# Altium project Motor-42.PrjPCB
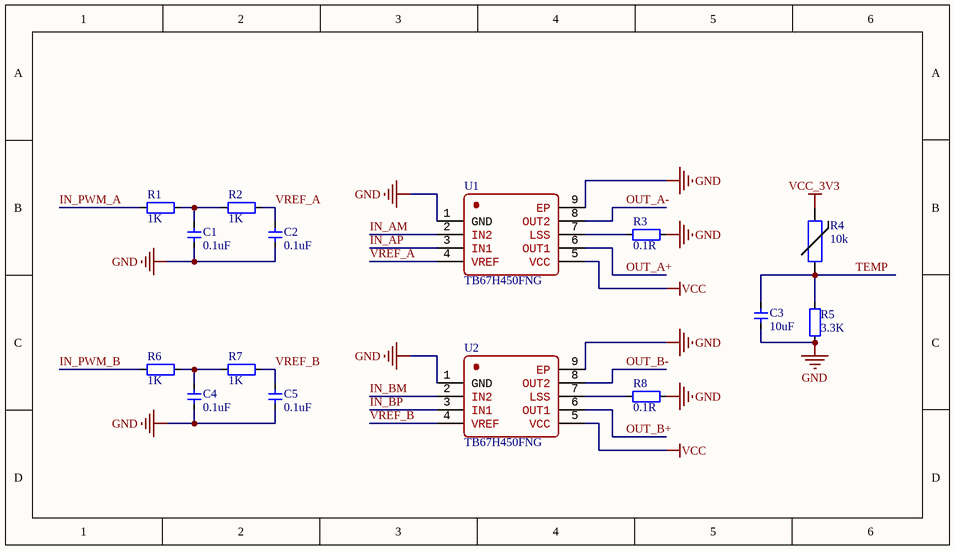
[diagram p0: Drive.SchDoc]
5 sheets, 78 parts. Net scope: global (net labels, ports and power ports of the same name join across sheets).
Board file: Motor-42.PcbDoc
Sheets:
  Drive.SchDoc
  MCU.SchDoc
  Port.SchDoc
  Power.SchDoc
  Interface.SchDoc

## Sheet Drive.SchDoc
size 177 x 101 mm; SheetNumber: 1; SheetTotal: 1

### Parts
C1  0.1uF  [CAP_0402]
C2  0.1uF  [CAP_0402]
C3  10uF  [CAP_0402]
C4  0.1uF  [CAP_0402]
C5  0.1uF  [CAP_0402]
R1  1K  [RES_0402]
R2  1K  [RES_0402]
R3  0.1R  [1206-RES]
R4  value 10k  [RES_0402]  (hidden comment: NCP15XH103F03RC)
R5  3.3K  [RES_0402]
R6  1K  [RES_0402]
R7  1K  [RES_0402]
R8  0.1R  [1206-RES]
U1  TB67H450FNG  [SO-8-PAD]
U2  TB67H450FNG  [SO-8-PAD]

### Nets
GND: C1.1 C2.1 C3.1 C4.1 C5.1 R3.2 R5.1 R8.2 U1.1(GND) U1.9(EP) U2.1(GND) U2.9(EP)
VCC: U1.5(VCC) U2.5(VCC)
VCC_3V3: R4.2
IN_AM: U1.2(IN2)
IN_AP: U1.3(IN1)
IN_BM: U2.2(IN2)
IN_BP: U2.3(IN1)
IN_PWM_A: R1.1
IN_PWM_B: R6.1
OUT_A+: U1.6(OUT1)
OUT_A-: U1.8(OUT2)
OUT_B+: U2.6(OUT1)
OUT_B-: U2.8(OUT2)
TEMP: C3.2 R4.1 R5.2
VREF_A: C2.2 R2.2 U1.4(VREF)
VREF_B: C5.2 R7.2 U2.4(VREF)
NetC1_2: C1.2 R1.2 R2.1
NetC4_2: C4.2 R6.2 R7.1
NetR3_1: R3.1 U1.7(LSS)
NetR8_1: R8.1 U2.7(LSS)

### Library data of the parts
C1-C5 = 电容-0402: Capacitor; Value: 0.1u
R1 R2 R5-R7 = 电阻-0402: Resistor; Value: 22R
R3 R8 = 电阻-1206: Resistor; Value: 22R
R4 = NCP15XH103F03RC: THERMISTOR 10K OHM NTC 0402 SMD
U1 U2 = TB67H450FNG: PWM Chopper Type DC Brushed Motor Driver

## Sheet MCU.SchDoc
size 177 x 114 mm; SheetNumber: 1; SheetTotal: 1
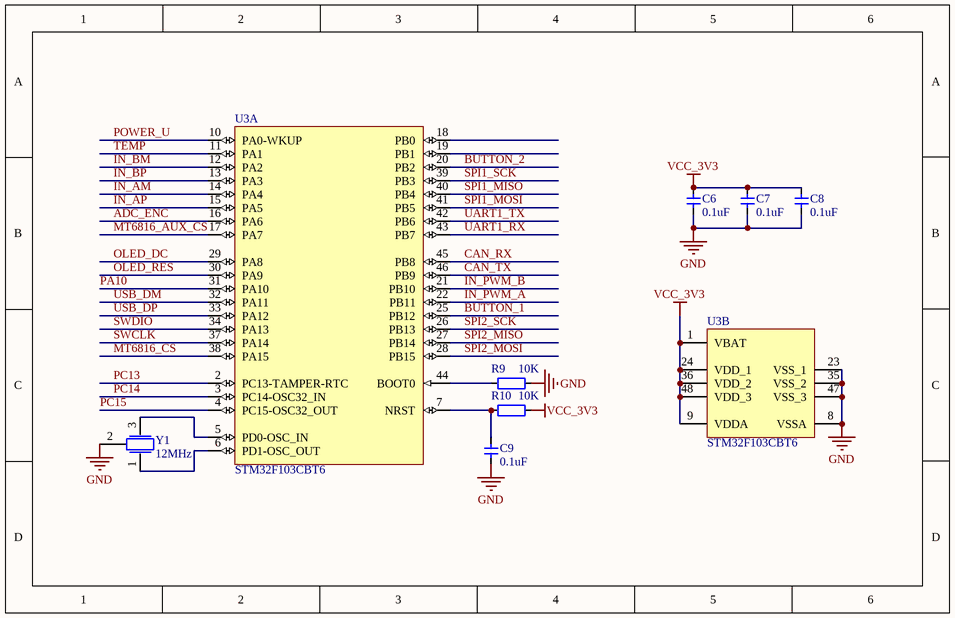
[diagram p1: MCU.SchDoc]

### Parts
C6  0.1uF  [CAP_0402]
C7  0.1uF  [CAP_0402]
C8  0.1uF  [CAP_0402]
C9  0.1uF  [CAP_0402]
R9  10K  [RES_0402]
R10  10K  [RES_0402]
U3  STM32F103CBT6  [LQFP-48]  (parts A,B of 2)
Y1  12MHz  [晶振-3P]

### Nets
GND: C6.1 C7.1 C8.1 C9.1 R9.2 U3.8(VSSA) U3.23(VSS_1) U3.35(VSS_2) U3.47(VSS_3) Y1.2
VCC_3V3: C6.2 C7.2 C8.2 R10.2 U3.1(VBAT) U3.9(VDDA) U3.24(VDD_1) U3.36(VDD_2) U3.48(VDD_3)
ADC_ENC: U3.16(PA6)
BUTTON_1: U3.25(PB12)
BUTTON_2: U3.20(PB2)
CAN_RX: U3.45(PB8)
CAN_TX: U3.46(PB9)
IN_AM: U3.14(PA4)
IN_AP: U3.15(PA5)
IN_BM: U3.12(PA2)
IN_BP: U3.13(PA3)
IN_PWM_A: U3.22(PB11)
IN_PWM_B: U3.21(PB10)
MT6816_AUX_CS: U3.17(PA7)
MT6816_CS: U3.38(PA15)
OLED_DC: U3.29(PA8)
OLED_RES: U3.30(PA9)
PA10: U3.31(PA10)
PC13: U3.2(PC13-TAMPER-RTC)
PC14: U3.3(PC14-OSC32_IN)
PC15: U3.4(PC15-OSC32_OUT)
POWER_U: U3.10(PA0-WKUP)
SPI1_MISO: U3.40(PB4)
SPI1_MOSI: U3.41(PB5)
SPI1_SCK: U3.39(PB3)
SPI2_MISO: U3.27(PB14)
SPI2_MOSI: U3.28(PB15)
SPI2_SCK: U3.26(PB13)
SWCLK: U3.37(PA14)
SWDIO: U3.34(PA13)
TEMP: U3.11(PA1)
UART1_RX: U3.43(PB7)
UART1_TX: U3.42(PB6)
USB_DM: U3.32(PA11)
USB_DP: U3.33(PA12)
NetC9_2: C9.2 R10.1 U3.7(NRST)
NetR9_1: R9.1 U3.44(BOOT0)
NetU3_5: U3.5(PD0-OSC_IN) Y1.3
NetU3_6: U3.6(PD1-OSC_OUT) Y1.1

Not connected (* = marked no-connect by the designer): U3 18(PB0) 19(PB1)

### Library data of the parts
C6-C9 = 电容-0402: Capacitor; Value: 0.1u
R9 R10 = 电阻-0402: Resistor; Value: 22R
U3 = STM32F103CBT6: ARM Cortex-M3 32-bit MCU, 128 KB Flash, 20 KB Internal RAM, 37 I/Os, 48-pin LQFP, -40 to 85 degC, Tray; A/D Converter: 2x12-bit (10 Channel); FLASH Size (Prog) (kB): 128; I/Os (High Current): 37; Internal RAM Size (kB): 20; Operating Frequency(F) (Processor speed) (MHz): 72; Supply Voltage(Vcc) min (V): 2; DatasheetVersion: Rev. 16; PackageVersion: Rev. 6, 06/2013; PackageReference: LQFP48; PackageDescription: 48-Pin Low Profile Quad Flat Package, 7 x 7 mm Body, 0.5 mm Pitch; Supplier 1: Digi-Key; Supplier Part Number 1: 497-6288-ND; Supplier 2: Farnell; Supplier Part Number 2: 1606327; Supplier 3: Newark; Supplier Part Number 3: 11N8296; Supplier 4: Newark; Supplier Part Number 4: 57P1214; Supplier 5: Mouser; Supplier Part Number 5: 511-STM32F103CBT6; Core: ARM Cortex-M3; Packing: Tray; Mounting Technology: Surface Mount; PartNumber: STM32F103CBT6; ComponentLink1Description: Manufacturer URL; ComponentLink1URL: http://www.st.com/web/en/home.html; ComponentLink2Description: Datasheet; ComponentLink2URL: http://www.st.com/st-web-ui/static/active/en/resource/technical/document/datasheet/CD00161566.pdf; ComponentLink3Description: Package Specification; ComponentLink3URL: http://www.st.com/st-web-ui/static/active/en/resource/technical/document/datasheet/DM00058181.pdf
Y1 = 晶振-3Pin: 村田贴片

## Sheet Port.SchDoc
size 177 x 165 mm; SheetNumber: 1; SheetTotal: 1
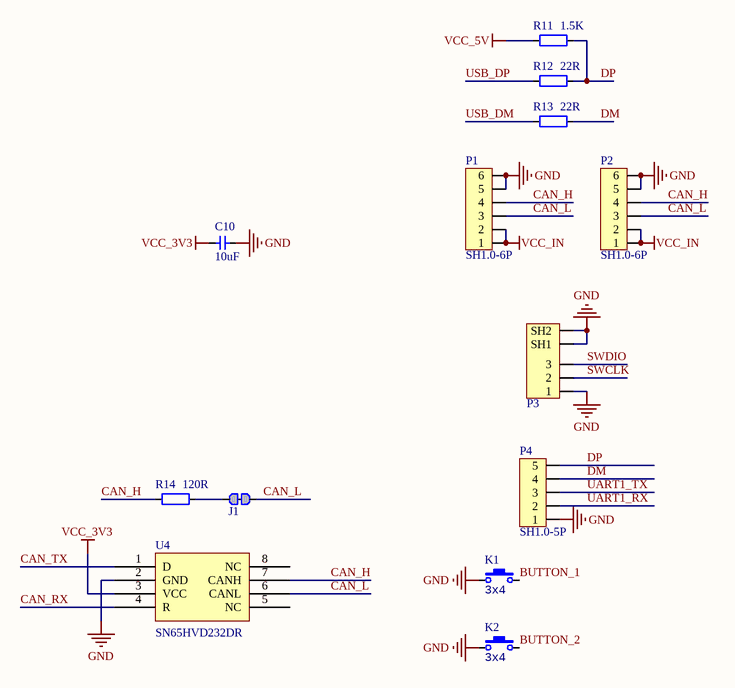
[diagram p2: Port.SchDoc]

### Parts
C10  10uF  [CAP_0402]
J1  跳线  [0402-0R]  (value not drawn)
K1  value 3x4  [ButtonTACT_3x4x2_180]  (hidden comment: TACT 2P)
K2  value 3x4  [ButtonTACT_3x4x2_180]  (hidden comment: TACT 2P)
P1  SH1.0-6P  [SH1.0-6P]
P2  SH1.0-6P  [SH1.0-6P]
P3  SH1.0-3P  [SH1.0-3P]  (value not drawn)
P4  SH1.0-5P  [SH1.0-5P]
R11  1.5K  [RES_0402]
R12  22R  [RES_0402]
R13  22R  [RES_0402]
R14  120R  [RES_0402]
U4  Manufacturer Part Number: SN65HVD232DR  [SO-8]  (hidden comment: SN65HVD232D)

### Nets
GND: C10.1 K1.1 K2.1 P1.5 P1.6 P2.5 P2.6 P3.1 P3.SH1 P3.SH2 P4.1 U4.2(GND)
VCC_3V3: C10.2 U4.3(VCC)
VCC_5V: R11.1
VCC_IN: P1.1 P1.2 P2.1 P2.2
BUTTON_1: K1.2
BUTTON_2: K2.2
CAN_H: P1.4 P2.4 R14.1 U4.7(CANH)
CAN_L: J1.2 P1.3 P2.3 U4.6(CANL)
CAN_RX: U4.4(R)
CAN_TX: U4.1(D)
DM: P4.4 R13.2
DP: P4.5 R11.2 R12.2
SWCLK: P3.2
SWDIO: P3.3
UART1_RX: P4.2
UART1_TX: P4.3
USB_DM: R13.1
USB_DP: R12.1
NetJ1_1: J1.1 R14.2

Not connected (* = marked no-connect by the designer): U4 5(NC) 8(NC)

### Library data of the parts
C10 = 电容-0402: Capacitor; Value: 0.1u
J1 = 跳线: Resistor; Published: 8-Jun-2000; LatestRevisionDate: 17-Jul-2002; LatestRevisionNote: Re-released for DXP Platform.; PackageReference: AXIAL-0.4; Publisher: Altium Limited; PackageDescription: Axial Device, Thru-Hole; 2 Leads; 0.4 in Pin Spacing
K1 K2 = ButtonTACT_3x4x2_180: Button; type: TACT 2P
P3 = SH1.0-3P: Header
R11 R14 = 电阻-0402: Resistor; Value: 22R
R12 R13 = 电阻-0402: Resistor; Value: 22R
U4 = SN65HVD232D: Manufacturer: Texas Instruments; Protocol: CAN; Number of Drivers/Receivers: 1/1; Duplex: Half; Data Rate: 1Mbps; Voltage - Supply: 3 V ~ 3.6 V; Supplier 1: Digi-Key; Supplier Part Number 1: 296-26344-2-ND; RoHS: RoHS Compliant; Category: Integrated Circuits (ICs); Stock: 5000; Pricing 1: 2500=0.84375 (USD); Packaging: Tape & Reel (TR); Part Status: Active; Type: Transceiver; Operating Temperature: -40°C ~ 85°C; Mounting Type: Surface Mount; Package / Case: 8-SOIC (0.154", 3.90mm Width); Supplier Device Package: 8-SOIC; ComponentLink1URL: http://www.ti.com/lit/ds/symlink/sn65hvd230.pdf; ComponentLink1Description: http://www.ti.com/lit/ds/symlink/sn65hvd230.pdf; Supplier 2: Digi-Key; Supplier Part Number 2: 296-26344-1-ND; Pricing 2: 1=2.05, 10=1.842, 100=1.4809, 500=1.21668, 1000=1.00811 (USD)

## Sheet Power.SchDoc
size 127 x 165 mm; SheetNumber: 1; SheetTotal: 1
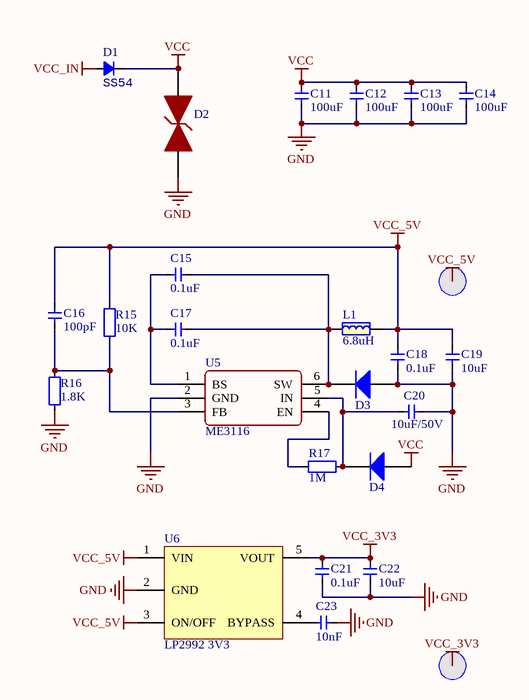
[diagram p3: Power.SchDoc]

### Parts
(Parts that share a designator on the sheet are numbered #1, #2 ... from top to bottom, then left to right.)
C11  100uF  [1206-CAP]
C12  100uF  [1206-CAP]
C13  100uF  [1206-CAP]
C14  100uF  [1206-CAP]
C15  0.1uF  [CAP_0402]
C16  100pF  [CAP_0402]
C17  0.1uF  [CAP_0402]
C18  0.1uF  [CAP_0402]
C19  10uF  [CAP_0402]
C20  10uF/50V  [CAP_0402]
C21  0.1uF  [CAP_0402]
C22  10uF  [CAP_0402]
C23  10nF  [CAP_0402]
D1  SS54  [DO-214AC]
D2  SMBJ28CA  [SMBJ-CA_MFG]  (value not drawn)
D3  二极管-5819W  [SOD-323]  (value not drawn)
D4  二极管-5819W  [SOD-323]  (value not drawn)
L1  6.8uH  [IND-201612]
R15  10K  [RES_0402]
R16#1  1.8K  [RES_0402]
R17#1  1M  [RES_0402]
T1  测试点  [TEST_PT]  (value not drawn)
T2  测试点  [TEST_PT]  (value not drawn)
U5  ME3116  [SOT23-6]
U6  LP2992 3V3  [SOT23-5]

### Nets
GND: C11.1 C12.1 C13.1 C14.1 C18.1 C19.1 C20.1 C21.1 C22.1 C23.1 D2.1 D3.1(A) R16#1.1 U5.2(GND) U6.2(GND)
VCC: C11.2 C12.2 C13.2 C14.2 D1.2(K) D2.2 D4.1(A)
VCC_3V3: C21.2 C22.2 T2.0 U6.5(VOUT)
VCC_5V: C16.1 C18.2 C19.2 L1.2 R15.2 T1.0 U6.1(VIN) U6.3(ON/OFF)
VCC_IN: D1.1(A)
NetC15_1: C15.1 C17.1 D3.2(K) L1.1 U5.6(SW)
NetC15_2: C15.2 C17.2 U5.1(BS)
NetC16_2: C16.2 R15.1 R16#1.2 U5.3(FB)
NetC20_2: C20.2 D4.2(K) R17#1.1 U5.5(IN)
NetC23_2: C23.2 U6.4(BYPASS)
NetR17#1_2: R17#1.2 U5.4(EN)

### Library data of the parts
C11-C14 = 电容-1206: Capacitor; Value: 0.1u
C15-C23 = 电容-0402: Capacitor; Value: 0.1u
D1 = Diode_SMA: Diode; Type: SMA; Value: SS54
D3 D4 = 二极管-5819W: 40V
L1 = 电感-201612
R15 R16#1 R17#1 = 电阻-0402: Resistor; Value: 22R
U5 = ME3116: DC-DC
U6 = LP2992: LDO

## Sheet Interface.SchDoc
size 203 x 165 mm; SheetNumber: 1; SheetTotal: 1
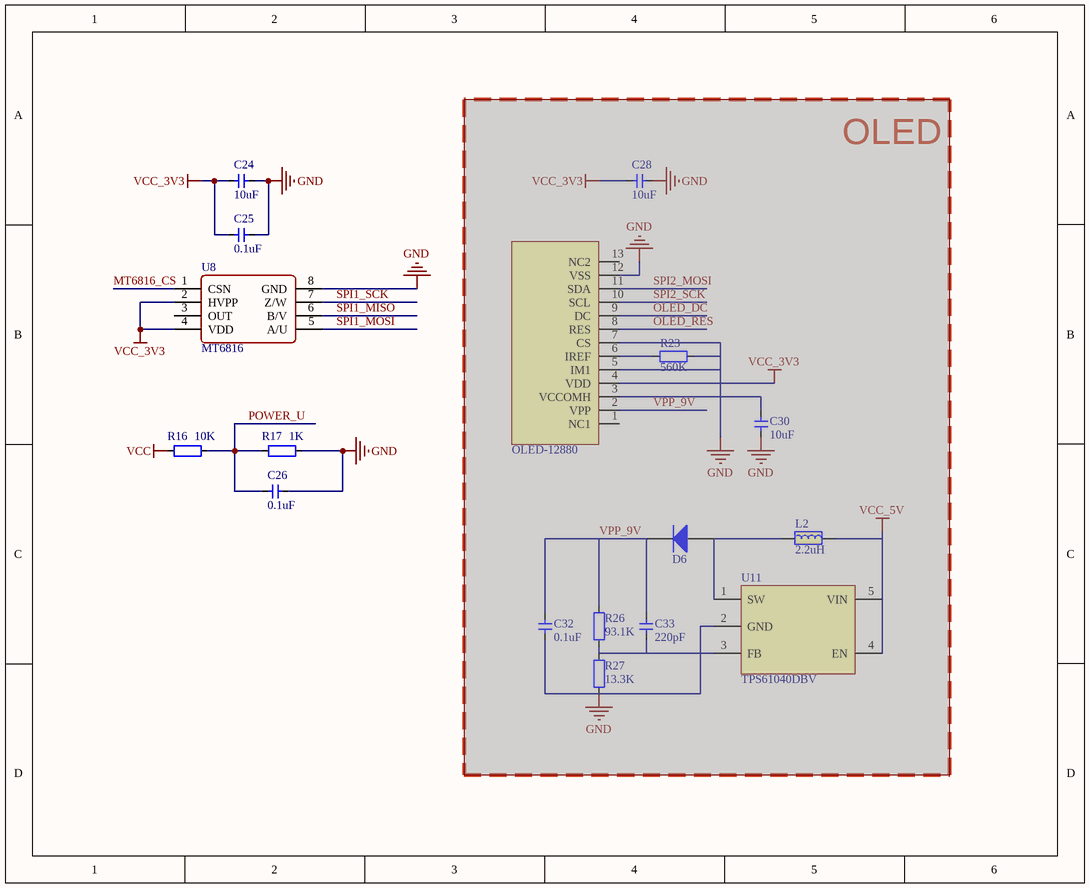
[diagram p4: Interface.SchDoc]

### Parts
(Parts that share a designator on the sheet are numbered #1, #2 ... from top to bottom, then left to right.)
1  OLED-12880  [OLED-12880]  (masked out: inside a compile mask, not in the netlist)
C24  10uF  [CAP_0402]
C25  0.1uF  [CAP_0402]
C26  0.1uF  [CAP_0402]
C28  10uF  [CAP_0402]  (masked out: inside a compile mask, not in the netlist)
C30  10uF  [CAP_0402]  (masked out: inside a compile mask, not in the netlist)
C32  0.1uF  [CAP_0402]  (masked out: inside a compile mask, not in the netlist)
C33  220pF  [CAP_0402]  (masked out: inside a compile mask, not in the netlist)
D6  二极管-5B5819WS  [SOD-323]  (value not drawn)  (masked out: inside a compile mask, not in the netlist)
L2  2.2uH  [2520-L]  (masked out: inside a compile mask, not in the netlist)
R16#2  10K  [RES_0402]
R17#2  1K  [RES_0402]
R23  560K  [RES_0402]  (masked out: inside a compile mask, not in the netlist)
R26  93.1K  [RES_0402]  (masked out: inside a compile mask, not in the netlist)
R27  13.3K  [RES_0402]  (masked out: inside a compile mask, not in the netlist)
U8  MT6816  [SO-8]
U11  TPS61040DBV  [SOT23-5]  (masked out: inside a compile mask, not in the netlist)

### Blocks framed on the sheet
OLED: 1 C28 C30 C32 C33 D6 L2 R23 R26 R27 U11

### Nets
GND: C24.1 C25.1 C26.1 R17#2.2 U8.8(GND)
VCC: R16#2.1
VCC_3V3: C24.2 C25.2 U8.2(HVPP) U8.4(VDD)
MT6816_CS: U8.1(CSN)
POWER_U: C26.2 R16#2.2 R17#2.1
SPI1_MISO: U8.6(B/V)
SPI1_MOSI: U8.5(A/U)
SPI1_SCK: U8.7(Z/W)

Not connected (* = marked no-connect by the designer): U8 3(OUT)

### Library data of the parts
C24-C26 C28 C30 C32 C33 = 电容-0402: Capacitor; Value: 0.1u
D6 = 二极管-5B5817WS: 40V
L2 = 电感-2520: 磁珠
R16#2 R17#2 R23 R26 R27 = 电阻-0402: Resistor; Value: 22R
U8 = MT6816: Magnetic Position Sensor
U11 = TPS61040DBV: MP: TPS61221DCK; MF: Texas Instruments; Price: None; SnapEDA_Link: https://www.snapeda.com/parts/TPS61221DCK/Texas%20Instruments/view-part/2767825/?ref=snap; Availability: Unavailable; Value: *; Package: SOT-363 Texas Instruments

## Nets that join several sheets
GND: Drive (12 pins), MCU (10 pins), Port (12 pins), Power (15 pins), Interface (5 pins)
VCC: Drive (U1.5 U2.5), Power (7 pins), Interface (R16#2.1)
VCC_3V3: Drive (R4.2), MCU (9 pins), Port (C10.2 U4.3), Power (C21.2 C22.2 T2.0 U6.5), Interface (C24.2 C25.2 U8.2 U8.4)
VCC_5V: Port (R11.1), Power (8 pins)
VCC_IN: Port (P1.1 P1.2 P2.1 P2.2), Power (D1.1)
BUTTON_1: MCU (U3.25), Port (K1.2)
BUTTON_2: MCU (U3.20), Port (K2.2)
CAN_RX: MCU (U3.45), Port (U4.4)
CAN_TX: MCU (U3.46), Port (U4.1)
IN_AM: Drive (U1.2), MCU (U3.14)
IN_AP: Drive (U1.3), MCU (U3.15)
IN_BM: Drive (U2.2), MCU (U3.12)
IN_BP: Drive (U2.3), MCU (U3.13)
IN_PWM_A: Drive (R1.1), MCU (U3.22)
IN_PWM_B: Drive (R6.1), MCU (U3.21)
MT6816_CS: MCU (U3.38), Interface (U8.1)
POWER_U: MCU (U3.10), Interface (C26.2 R16#2.2 R17#2.1)
SPI1_MISO: MCU (U3.40), Interface (U8.6)
SPI1_MOSI: MCU (U3.41), Interface (U8.5)
SPI1_SCK: MCU (U3.39), Interface (U8.7)
SWCLK: MCU (U3.37), Port (P3.2)
SWDIO: MCU (U3.34), Port (P3.3)
TEMP: Drive (C3.2 R4.1 R5.2), MCU (U3.11)
UART1_RX: MCU (U3.43), Port (P4.2)
UART1_TX: MCU (U3.42), Port (P4.3)
USB_DM: MCU (U3.32), Port (R13.1)
USB_DP: MCU (U3.33), Port (R12.1)